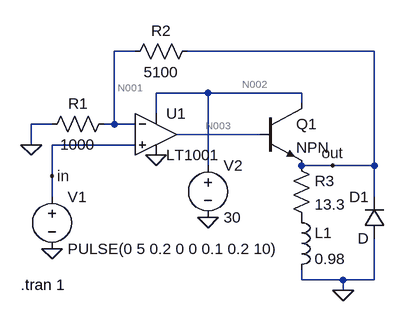
[diagram p0: schematic Ampli.asc]
Ampli.asc, the LTspice schematic file:
Version 4
SHEET 1 880 680
WIRE 192 -80 160 -80
WIRE 560 -80 272 -80
WIRE 304 -16 224 -16
WIRE 448 -16 304 -16
WIRE 448 0 448 -16
WIRE 224 16 224 -16
WIRE 64 32 32 32
WIRE 160 32 160 -80
WIRE 160 32 144 32
WIRE 192 32 160 32
WIRE 384 48 256 48
WIRE 32 64 32 32
WIRE 192 64 64 64
WIRE 304 96 304 -16
WIRE 496 96 448 96
WIRE 560 96 560 -80
WIRE 560 96 496 96
WIRE 64 112 64 64
WIRE 64 144 64 112
WIRE 560 144 560 96
WIRE 448 272 448 256
WIRE 512 272 448 272
WIRE 560 272 560 208
WIRE 560 272 512 272
WIRE 512 288 512 272
FLAG 224 80 0
FLAG 64 224 0
FLAG 304 176 0
FLAG 512 288 0
FLAG 32 64 0
FLAG 496 96 out
FLAG 64 112 in
SYMBOL voltage 64 128 R0
WINDOW 123 0 0 Left 0
WINDOW 39 0 0 Left 0
SYMATTR InstName V1
SYMATTR Value PULSE(0 5 0.2 0 0 0.1 0.2 10)
SYMBOL res 160 16 R90
WINDOW 0 0 56 VBottom 2
WINDOW 3 32 56 VTop 2
SYMATTR InstName R1
SYMATTR Value 1000
SYMBOL res 288 -96 R90
WINDOW 0 0 56 VBottom 2
WINDOW 3 32 56 VTop 2
SYMATTR InstName R2
SYMATTR Value 5100
SYMBOL npn 384 0 R0
SYMATTR InstName Q1
SYMBOL voltage 304 80 R0
WINDOW 123 0 0 Left 0
WINDOW 39 0 0 Left 0
SYMATTR InstName V2
SYMATTR Value 30
SYMBOL res 432 80 R0
SYMATTR InstName R3
SYMATTR Value 13.3
SYMBOL ind 432 160 R0
SYMATTR InstName L1
SYMATTR Value 0.98
SYMBOL diode 576 208 R180
WINDOW 0 24 64 Left 2
WINDOW 3 24 0 Left 2
SYMATTR InstName D1
SYMBOL OpAmps\\LT1001 224 -16 R0
SYMATTR InstName U1
TEXT 16 280 Left 2 !.tran 1

The netlist it stands for:
* Ampli.asc
V1 in 0 PULSE(0 5 0.2 0 0 0.1 0.2 10)
R1 N001 0 1000
R2 out N001 5100
Q1 N002 N003 out 0 NPN
V2 N002 0 30
R3 out P001 13.3
L1 P001 0 0.98
D1 0 out D
XU1 in N001 N002 0 N003 LT1001  ; pins In+ In- V+ V- OUT
.model D D
.lib standard.dio
.model NPN NPN
.model PNP PNP
.lib standard.bjt
.tran 1
.lib LTC.lib
.backanno
.end

* Results of the author's LTspice run, read from the files saved beside the schematic
* Operating Point, zero values left out:
*   V(n001) = 49.79 mV
*   V(out) = 303.7 mV
*   V(n002) = 30 V
*   V(n003) = 1.159 V
*   V(p001) = 22.83 µV
*   Ic(Q1) = 22.66 mA
*   Ib(Q1) = 226.6 µA
*   Ie(Q1) = -22.88 mA
*   I(L1) = 22.83 mA
*   I(R1) = 49.79 µA
*   I(R2) = 49.79 µA
*   I(R3) = 22.83 mA
*   I(V1) = 698.9 pA
*   I(V2) = -25.02 mA
*   Ix(u1:1) = -698.9 pA
*   Ix(u1:2) = 645.4 pA
*   Ix(u1:3) = 2.365 mA
*   Ix(u1:4) = -2.138 mA
*   Ix(u1:5) = -226.6 µA
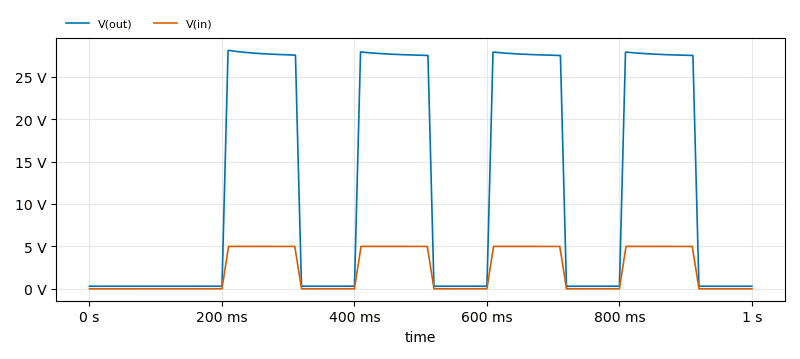
[diagram p1: Transient Analysis of Ampli.asc, plotted from the saved traces]
* Transient Analysis, 1 run:
*   V(out): min 303.7 mV, max 28.1 V, average 12.44 V, rms 18.19 V, last 303.7 mV
*   V(in): min 0 V, max 5.002 V, average 2.2 V, rms 3.266 V, last 0 V